# Altium project TECLADO.PrjPcb
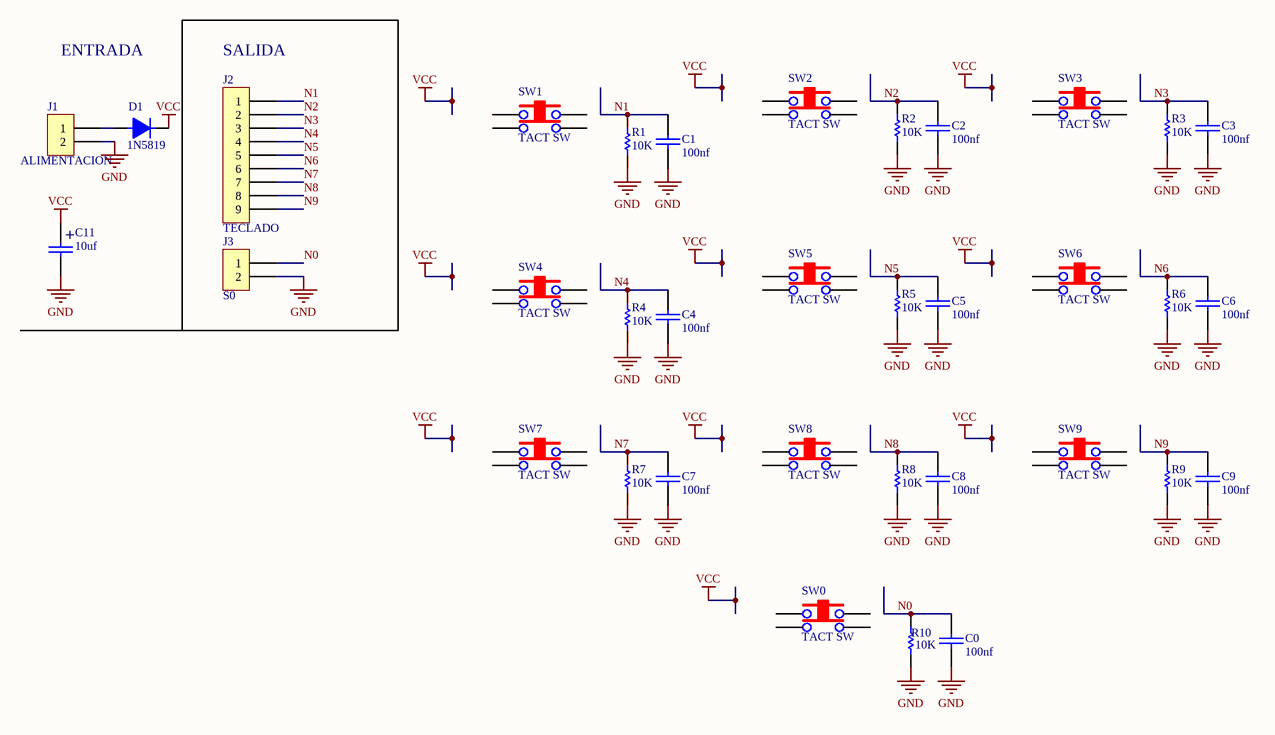
[diagram p0: ESQUEMATICO.SchDoc]
1 sheet, 35 parts. Net scope: global (net labels, ports and power ports of the same name join across sheets).
Board files: PCB.PcbDoc, PANEL.PcbDoc

## Sheet ESQUEMATICO.SchDoc
size A4

### Parts
C0  100nf  [CAP200]
C1  100nf  [CAP200]
C2  100nf  [CAP200]
C3  100nf  [CAP200]
C4  100nf  [CAP200]
C5  100nf  [CAP200]
C6  100nf  [CAP200]
C7  100nf  [CAP200]
C8  100nf  [CAP200]
C9  100nf  [CAP200]
C11  10uf  [CAP100RP]
D1  1N5819  [DO41]
J1  ALIMENTACION  [BORNERA2]
J2  TECLADO  [BORNERA9]
J3  S0  [BORNERA2]
R1  10K  [RES400]
R2  10K  [RES400]
R3  10K  [RES400]
R4  10K  [RES400]
R5  10K  [RES400]
R6  10K  [RES400]
R7  10K  [RES400]
R8  10K  [RES400]
R9  10K  [RES400]
R10  10K  [RES400]
SW0  TACT SW  [TACTSWITCH]
SW1  TACT SW  [TACTSWITCH]
SW2  TACT SW  [TACTSWITCH]
SW3  TACT SW  [TACTSWITCH]
SW4  TACT SW  [TACTSWITCH]
SW5  TACT SW  [TACTSWITCH]
SW6  TACT SW  [TACTSWITCH]
SW7  TACT SW  [TACTSWITCH]
SW8  TACT SW  [TACTSWITCH]
SW9  TACT SW  [TACTSWITCH]

### Nets
GND: C0.2 C1.2 C2.2 C3.2 C4.2 C5.2 C6.2 C7.2 C8.2 C9.2 C11.2 J1.2 J3.2 R1.1 R2.1 R3.1 R4.1 R5.1 R6.1 R7.1 R8.1 R9.1 R10.1
VCC: C11.1 D1.2
N0: C0.1 J3.1 R10.2
N1: C1.1 J2.1 R1.2
N2: C2.1 J2.2 R2.2
N3: C3.1 J2.3 R3.2
N4: C4.1 J2.4 R4.2
N5: C5.1 J2.5 R5.2
N6: C6.1 J2.6 R6.2
N7: C7.1 J2.7 R7.2
N8: C8.1 J2.8 R8.2
N9: C9.1 J2.9 R9.2
NetD1_1: D1.1 J1.1

Not connected (* = marked no-connect by the designer): SW0 1 2 3 4; SW1 1 2 3 4; SW2 1 2 3 4; SW3 1 2 3 4; SW4 1 2 3 4; SW5 1 2 3 4; SW6 1 2 3 4; SW7 1 2 3 4; SW8 1 2 3 4; SW9 1 2 3 4

### Notes on the sheet
- ENTRADA
- (near J2) SALIDA
- (in symbol CAPPOL) +

### Library data of the parts
C0-C9 = CAP
C11 = CAPPOL
D1 = DIODO
J1 J3 = BORNERA 2
J2 = BORNERA 9
R1-R10 = RES
SW0-SW9 = Pulsador: Autor: Guido Spataro; Data: Libebal; Fecha: 07/04/19